# Altium schematic sheet CLK_INPUT.SchDoc: FMC ADC 128CH 10B
size 420 x 297 mm; EDA_Number: ARTIQ; Projet: ARTIQ/SINARA; Author: G.Kasprowicz; CompanyName: WUT ISE; DrawnBy: G.Kasprowicz; Organization: WUT ISE; Address1: PW ISE; Address2: Nowowiejska 15/19 00-665 Warsaw; Address3: gkasprow@gmail.com; DocumentNumber: 1; Revision: 1; SheetNumber: 1; SheetTotal: 9; ModifiedBy: -; CheckedDate: -; Title2: CLK INPUT; DivGrp: WUT ISE; Designer: G.Kasprowicz; ModifiedDate: -; ProjectName: Sensor Box
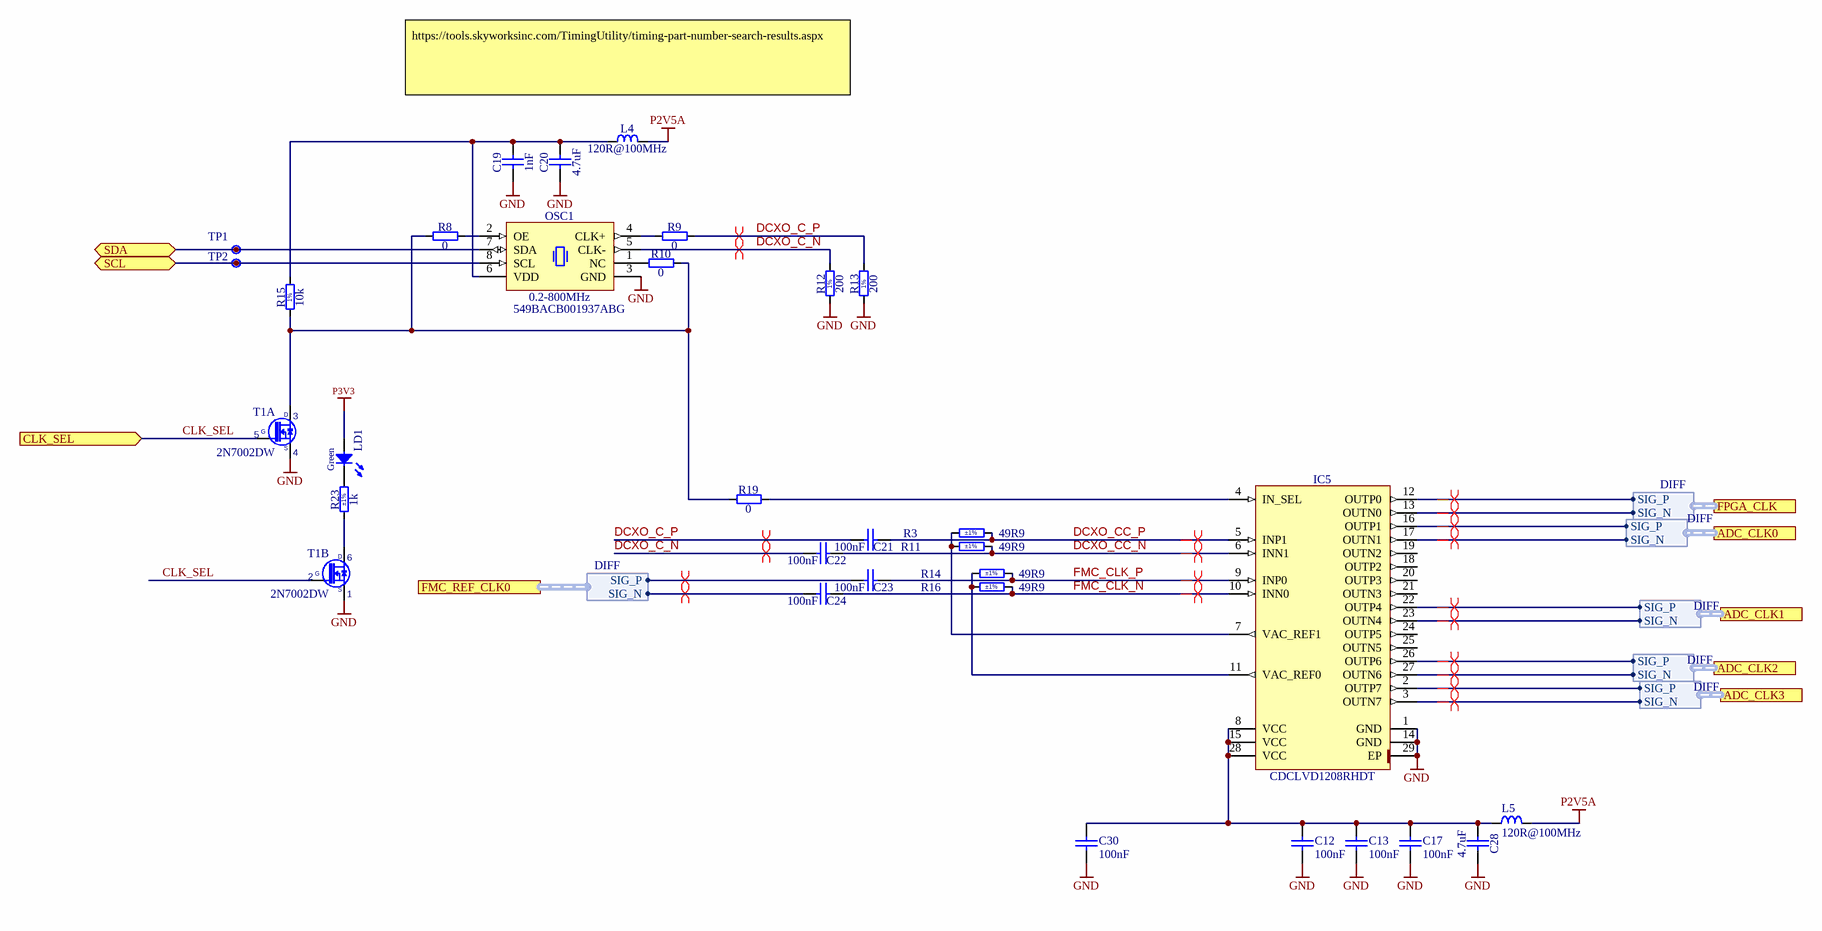
[diagram p0: CLK_INPUT.SchDoc]

## Parts
C12  100nF  [CAPC0603X33N]
C13  100nF  [CAPC0603X33N]
C17  100nF  [CAPC0603X33N]
C19  1nF  [CAPC1005X55N]
C20  4.7uF  [CAPC2012X135N]
C21  100nF  [CAPC0603X33N]
C22  100nF  [CAPC0603X33N]
C23  100nF  [CAPC0603X33N]
C24  100nF  [CAPC0603X33N]
C28  4.7uF  [CAPC2012X135N]
C30  100nF  [CAPC0603X33N]
IC5  CDCLVD1208RHDT  [QFN50P500X500X100-29N-S325]
L4  120R@100MHz  [INDC1608X65N]
L5  120R@100MHz  [INDC1608X95N]
LD1  Green  [LED_KINGBRIGHT_KPA-1606CGCK]
OSC1  0.2-800MHz  Manufacturer Part Number: 549BACB001937ABG  [OSC_SILICON-LAB_SI549-A]
R3  49R9  Tolerance: ±1%  [RESC1005X40N]
R8  0  [RESC1005X40N]
R9  0  [RESC1005X40N]
R10  0  [RESC1005X40N]
R11  49R9  Tolerance: ±1%  [RESC1005X40N]
R12  200  [RESC1005X40N]
R13  200  [RESC1005X40N]
R14  49R9  Tolerance: ±1%  [RESC1005X40N]
R15  10k  [RESC1005X40N]
R16  49R9  Tolerance: ±1%  [RESC1005X40N]
R19  0  [RESC1005X40N]
R23  1k  Tolerance: ±1%  [RESC1005X40N]
T1  2N7002DW  [SOT65P210X110-6N]  (parts A,B of 2)
TP1  I2C SW SDA  [TPS127]  (value not drawn)  (no BOM)
TP2  I2C SW SCL  [TPS127]  (value not drawn)  (no BOM)

## Ports
ADC_CLK0 (harness DIFF), ADC_CLK1 (harness DIFF), ADC_CLK2 (harness DIFF), ADC_CLK3 (harness DIFF), CLK_SEL (in), FMC_REF_CLK0 (harness DIFF), FPGA_CLK (harness DIFF), SCL (bidir), SDA (bidir)

## Harnesses
DIFF: SIG_P, SIG_N

## Nets
GND: C12.1 C13.1 C17.1 C19.1 C20.1 C28.1 C30.1 IC5.1(GND) IC5.14(GND) IC5.29(EP) OSC1.3(GND) R12.1 R13.1 T1.1(S2) T1.4(S1)
P2V5A: L4.1 L5.2
P3V3: LD1.2(A)
CLK_SEL: T1.2(G2) T1.5(G1) ; port CLK_SEL
DCXO_C_N: C22.1 OSC1.5(CLK-) R12.2
DCXO_C_P: C21.1 R9.2 R13.2
DCXO_CC_N: C22.2 IC5.6(INN1) R11.2
DCXO_CC_P: C21.2 IC5.5(INP1) R3.2
FMC_CLK_N: C24.2 IC5.10(INN0) R16.2
FMC_CLK_P: C23.2 IC5.9(INP0) R14.2
SCL: OSC1.8(SCL) TP2.1 ; port SCL
SDA: OSC1.7(SDA) TP1.1 ; port SDA
NetC12_2: C12.2 C13.2 C17.2 C28.2 C30.2 IC5.8(VCC) IC5.15(VCC) IC5.28(VCC) L5.1
NetC19_2: C19.2 C20.2 L4.2 OSC1.6(VDD) R15.2
NetC23_1: C23.1 ; port FMC_REF_CLK0.SIG_P
NetC24_1: C24.1 ; port FMC_REF_CLK0.SIG_N
NetIC5_2: IC5.2(OUTP7) ; port ADC_CLK3.SIG_P
NetIC5_3: IC5.3(OUTN7) ; port ADC_CLK3.SIG_N
NetIC5_4: IC5.4(IN_SEL) R19.2
NetIC5_7: IC5.7(VAC_REF1) R3.1 R11.1
NetIC5_11: IC5.11(VAC_REF0) R14.1 R16.1
NetIC5_12: IC5.12(OUTP0) ; port FPGA_CLK.SIG_P
NetIC5_13: IC5.13(OUTN0) ; port FPGA_CLK.SIG_N
NetIC5_16: IC5.16(OUTP1) ; port ADC_CLK0.SIG_P
NetIC5_17: IC5.17(OUTN1) ; port ADC_CLK0.SIG_N
NetIC5_22: IC5.22(OUTP4) ; port ADC_CLK1.SIG_P
NetIC5_23: IC5.23(OUTN4) ; port ADC_CLK1.SIG_N
NetIC5_26: IC5.26(OUTP6) ; port ADC_CLK2.SIG_P
NetIC5_27: IC5.27(OUTN6) ; port ADC_CLK2.SIG_N
NetLD1_1: LD1.1(C) R23.2
NetOSC1_1: OSC1.1(NC) R10.1
NetOSC1_2: OSC1.2(OE) R8.2
NetOSC1_4: OSC1.4(CLK+) R9.1
NetR8_1: R8.1 R10.2 R15.1 R19.1 T1.3(D1)
NetR23_1: R23.1 T1.6(D2)

Not connected (* = marked no-connect by the designer): IC5 18(OUTP2) 19(OUTN2) 20(OUTP3) 21(OUTN3) 24(OUTP5) 25(OUTN5)

## Layout directives
differential pair; differential pair class Diff_100Ohm: DCXO_C_N, DCXO_C_P
differential pair: DCXO_C_N, DCXO_C_P, DCXO_CC_N, DCXO_CC_P, FMC_CLK_N, FMC_CLK_P, NetC23_1, NetC24_1, NetIC5_2, NetIC5_3, NetIC5_12, NetIC5_13, NetIC5_16, NetIC5_17, NetIC5_22, NetIC5_23, NetIC5_26, NetIC5_27

## Notes on the sheet
- https://tools.skyworksinc.com/TimingUtility/timing-part-number-search-results.aspx
- Project/Equipment
- Document
- Designer
- Drawn by
- Check.by
- Copyright WUT ISE 2018.
  This documentation describes Open Hardware and is licensed under the CERN OHL v.1.1. You may redistribute and modify this documentation under the terms of the CERN OHL v.1.1. (http://ohwr.org/CERNOHL). This documentation is distributed WITHOUT ANY EXPRESS OR IMPLIED WARRANTY, INCLUDING OF MERCHANTABILITY, SATISFACTORY QUALITY AND FITNESS FOR A PARTICULAR PURPOSE. Please see the CERN OHL v.1.1 for applicable conditions.
- Contact
- File
- Last Mod.
- Print Date
- Sheet
- Size
- A3
- of
- Rev
- (in symbol 2N7002DW, part A) D; G; S
- (in symbol 2N7002DW, part B) D; G; S
- (in symbol R0402_10K_1%_0.0625W_100PPM) 1%
- (in symbol R0402_200R_1%_0.0625W_100PPM) 1%

## Library data of the parts
C12 C13 C17 C21-C24 C30 = CC0201_100NF_6.3V_10%_X5R: Non-polarised capacitor; Part Description: SMD Multilayer Chip Ceramic Capacitor; Manufacturer: GENERIC; Manufacturer1 Part Number: 02016D104KAT2A; Voltage: 6.3V; TC: X5R; Tolerance: ±10%; Part Number: CC0201_100NF_6.3V_10%_X5R; Component Kind: Standard; Component Type: Standard; Pin Count: 2; Value: 100nF; Status: Not Recommended; Manufacturer Part Number: CC0201_100NF_6.3V_10%_X5R; Case: 0201; Mounted: Yes; Socket: No; SMD: Yes; Sense: No; Manufacturer1 Example: AVX; Manufacturer1 ComponentHeight: 0.33mm; HelpURL: \\cern.ch\dfs\Applications\Altium\Datasheets\CC0201_X5R_AVX.pdf; Author: CERN DEM JLC; CreateDate: 03.12.2007; LatestRevisionDate: 03.12.2007
C19 = CC0402_1NF_50V_10%_X7R: Non-polarised capacitor; Part Description: SMD Multilayer Chip Ceramic Capacitor; Manufacturer: GENERIC; Manufacturer1 Part Number: 223858715623; Voltage: 50V; TC: X7R; Tolerance: ±10%; Part Number: CC0402_1NF_50V_10%_X7R; Component Kind: Standard; Component Type: Standard; Pin Count: 2; Value: 1nF; Status: Not Recommended; Manufacturer Part Number: CC0402_1NF_50V_10%_X7R; Case: 0402; Mounted: Yes; Socket: No; SMD: Yes; Sense: No; Manufacturer1 Example: PHYCOMP; Manufacturer1 ComponentHeight: 0.55mm; HelpURL: \\cern.ch\dfs\Applications\Altium\Datasheets\CC0402_X7R_PHYCOMP.pdf; Author: CERN DEM JLC; CreateDate: 03.12.2007; LatestRevisionDate: 03.12.2007
C20 C28 = CC0805_4.7UF_10V_10%_X5R: Non-polarised capacitor; Part Description: SMD Multilayer Chip Ceramic Capacitor; Manufacturer: GENERIC; Manufacturer1 Part Number: 222224013672; Voltage: 10V; TC: X5R; Tolerance: ±10%; Part Number: CC0805_4.7UF_10V_10%_X5R; Component Kind: Standard; Component Type: Standard; Pin Count: 2; Value: 4.7uF; Status: Preferred; Manufacturer Part Number: CC0805_4.7UF_10V_10%_X5R; Case: 0805; Mounted: Yes; Socket: No; SMD: Yes; Sense: No; Manufacturer1 Example: PHYCOMP; Manufacturer1 ComponentHeight: 1.45mm; HelpURL: \\cern.ch\dfs\Applications\Altium\Datasheets\CC0805_X5R_PHYCOMP_HC.pdf; Author: CERN DEM JLC; CreateDate: 03.12.2007; LatestRevisionDate: 03.12.2007
IC5 = CDCLVD1208RHDT: 2:8 Low Additive Jitter LVDS Buffer; Manufacturer: TEXAS INSTRUMENTS; PressFit: No; Bonding: No; Part Number: CDCLVD1208RHDT; Component Kind: Standard; Component Type: Standard; Device: CDCLVD1208RHDT; PackageDescription: QFN, 0.50mm Pitch, Square; 28 pin, 5.00mm L X 5.00mm W X 1.00mm H body (w/Thermal Tab 3.25 X 3.25mm), IPC Medium Density; Part Description: 2:8 Low Additive Jitter LVDS Buffer; Manufacturer Part Number: CDCLVD1208RHDT; Pin Count: 29; Case: QFN28; Mounted: Yes; Socket: No; SMD: Yes; Sense: No; ComponentHeight: 1mm; HelpURL: \\cern.ch\dfs\Applications\Altium\Datasheets\CDCLVD1208RHDT.pdf; Author: CERN DEM JLC; CreateDate: 28.06.2012; LatestRevisionDate: 28.06.2012
L4 = IND0603_MURATA_BLM18SG121TN1D: Inductor; Part Description: SMD EMIFIL Suppression Chip Ferrite Bead; Manufacturer: MURATA; Power: 3A; Resistance: 0.025R; Tolerance: ±25%; Part Number: IND0603_MURATA_BLM18SG121TN1D; Component Kind: Standard; Component Type: Standard; Pin Count: 2; Value: 120R@100MHz; Status: None; Manufacturer Part Number: BLM18SG121TN1D; Case: 0603; Mounted: Yes; Socket: No; SMD: Yes; Sense: No; ComponentHeight: 0.65mm; HelpURL: \\cern.ch\dfs\Applications\Altium\Datasheets\IND0603_MURATA_BLM18S.pdf; Author: CERN DEM JLC; CreateDate: 23.07.2014; LatestRevisionDate: 23.07.2014
L5 = IND0603_MURATA_BLM18PG121SN1D: Inductor; Part Description: SMD EMIFIL Chip Ferrite Bead; Manufacturer: MURATA; Power: 2A; Resistance: 0.05R; Part Number: IND0603_MURATA_BLM18PG121SN1D; Component Kind: Standard; Component Type: Standard; Pin Count: 2; Value: 120R@100MHz; Status: None; Manufacturer Part Number: BLM18PG121SN1D; Case: 0603; Mounted: Yes; Socket: No; SMD: Yes; Sense: No; ComponentHeight: 0.95mm; HelpURL: \\cern.ch\dfs\Applications\Altium\Datasheets\IND0603_MURATA_BLM18P.pdf; Author: CERN DEM BC; CreateDate: 2015-07-27; LatestRevisionDate: 2015-07-27
LD1 = LED_KINGBRIGHT_KPA-1606CGCK: LED Green 1C 2A; Part Description: SMD Green LED, Right Angle Mount, Body L 1.6 x W 0.6mm, 1.2mm Thickness; PressFit: No; Bonding: No; Part Number: LED_KINGBRIGHT_KPA-1606CGCK; Component Kind: Standard; Component Type: Standard; Color: Green; PackageDescription: SMT Green LED, Right Angle Mount, Body L 1.6 x W 0.6mm H 1.2mm; Status: Not Recommended; Manufacturer: KINGBRIGHT; Manufacturer Part Number: KPA-1606CGCK; Pin Count: 2; Case: 0603; Mounted: Yes; Socket: No; SMD: Yes; Sense: No; ComponentHeight: 1.2mm; HelpURL: \\cern.ch\dfs\Applications\Altium\Datasheets\LED_KINGBRIGHT_KPA-1606CGCK.pdf; Author: CERN DEM MR; CreateDate: 18.12.2017; LatestRevisionDate: 18.12.2017
OSC1 = OSC_0.2-800MHZ_SILICON-LAB_549BACB001937ABG: Ultra Low Jitter I2C Programmable Crystal Oscillator (XO), Si549 Series; Part Description: 0.2-800MHz, 1.8V/2.5V/3.3V ±20ppm LVDS, Ultra Low Jitter I2C Programmable Crystal Oscillator (XO), Si549 Series; Manufacturer: SILICON LABS; PressFit: No; Bonding: No; Part Number: OSC_0.2-800MHZ_SILICON-LAB_549BACB001937ABG; Component Kind: Standard; Component Type: Standard; PackageDescription: Oscillator Si549 Series, 8 pins, 5x7mm; Value: 0.2-800MHz; Pin Count: 8; Mounted: Yes; Socket: No; SMD: Yes; Sense: No; ComponentHeight: 1.33mm; HelpURL: \\cern.ch\dfs\Applications\Altium\Datasheets\OSC_SILICON-LAB_SI549.pdf; Author: CERN DEM JMW; CreateDate: 27/11/2019; LatestRevisionDate: 02/12/2019
R3 R11 R14 R16 = R0402_49R9_1%_0.0625W_100PPM: Resistor - 1%; Part Description: General Purpose Thick Film Chip Resistor; Manufacturer: GENERIC; Manufacturer1 Part Number: 232270674999L or RC0402FR-0749R9L; TC: ±100ppm/°C; PressFit: No; Part Number: R0402_49R9_1%_0.0625W_100PPM; Component Kind: Standard; Component Type: Standard; Pin Count: 2; Value: 49R9; Status: Not Recommended; Power: 0.0625W; Manufacturer Part Number: R0402_49R9_1%_0.0625W_100PPM; Case: 0402; Mounted: Yes; Sense: No; Socket: No; SMD: Yes; Manufacturer1 Example: YAGEO PHYCOMP; Manufacturer1 ComponentHeight: 0.4mm; HelpURL: \\cern.ch\dfs\Applications\Altium\Datasheets\R0402_Phycomp_RC0402.pdf; Author: CERN DEM JLC; CreateDate: 24.10.2012; LatestRevisionDate: 24.10.2012
R8-R10 R19 = R0402_0R_JUMPER: Resistor; Part Description: 1A (0.05R Max DC Resistance) Zero Ohm Jumper; Manufacturer: GENERIC; Manufacturer1 Part Number: 232270591001L; PressFit: No; Part Number: R0402_0R_JUMPER; Component Kind: Standard; Component Type: Standard; Pin Count: 2; Value: 0; Status: Not Recommended; Manufacturer Part Number: R0402_0R_JUMPER; Case: 0402; Mounted: Yes; Sense: No; Socket: No; SMD: Yes; Manufacturer1 Example: YAGEO PHYCOMP; Manufacturer1 ComponentHeight: 0.4mm; HelpURL: \\cern.ch\dfs\Applications\Altium\Datasheets\R0402_Phycomp_RC0402.pdf; Author: CERN DEM JLC; CreateDate: 03.12.2007; LatestRevisionDate: 17.10.2012
R12 R13 = R0402_200R_1%_0.0625W_100PPM: Resistor - 1%; Part Description: General Purpose Thick Film Chip Resistor; Manufacturer: GENERIC; Manufacturer1 Part Number: 232270672001L; TC: ±100ppm/°C; PressFit: No; Part Number: R0402_200R_1%_0.0625W_100PPM; Component Kind: Standard; Component Type: Standard; Pin Count: 2; Value: 200; Status: Not Recommended; Power: 0.0625W; Tolerance: ±1%; Manufacturer Part Number: R0402_200R_1%_0.0625W_100PPM; Case: 0402; Mounted: Yes; Sense: No; Socket: No; SMD: Yes; Manufacturer1 Example: YAGEO PHYCOMP; Manufacturer1 ComponentHeight: 0.4mm; HelpURL: \\cern.ch\dfs\Applications\Altium\Datasheets\R0402_Phycomp_RC0402.pdf; Author: CERN DEM JLC; CreateDate: 03.12.2007; LatestRevisionDate: 17.10.2012
R15 = R0402_10K_1%_0.0625W_100PPM: Resistor - 1%; Part Description: General Purpose Thick Film Chip Resistor; Manufacturer: GENERIC; Manufacturer1 Part Number: 232270671003L; TC: ±100ppm/°C; Table: Resistors SMD; Part Number: R0402_10K_1%_0.0625W_100PPM; Component Kind: Standard; Component Type: Standard; Pin Count: 2; Value: 10k; Status: Not recommended; Power: 0.0625W; Tolerance: ±1%; Manufacturer Part Number: R0402_10K_1%_0.0625W_100PPM; Case: 0402; Mounted: Yes; Socket: No; SMD: Yes; Manufacturer1 Example: YAGEO PHYCOMP; Manufacturer1 ComponentHeight: 0.4mm; HelpURL: \\cern.ch\dfs\Applications\Altium\Datasheets\R0402_Phycomp_RC0402.pdf; Author: CERN DEM JLC; CreateDate: 3/12/2007; LatestRevisionDate: 17/10/2012
R23 = R0402_1K_1%_0.0625W_100PPM: Resistor - 1%; Part Description: General Purpose Thick Film Chip Resistor; Manufacturer: GENERIC; Manufacturer1 Part Number: 232270671002L; TC: ±100ppm/°C; PressFit: No; Part Number: R0402_1K_1%_0.0625W_100PPM; Component Kind: Standard; Component Type: Standard; Pin Count: 2; Value: 1k; Status: Not Recommended; Power: 0.0625W; Manufacturer Part Number: R0402_1K_1%_0.0625W_100PPM; Case: 0402; Mounted: Yes; Sense: No; Socket: No; SMD: Yes; Manufacturer1 Example: YAGEO PHYCOMP; Manufacturer1 ComponentHeight: 0.4mm; HelpURL: \\cern.ch\dfs\Applications\Altium\Datasheets\R0402_Phycomp_RC0402.pdf; Author: CERN DEM JLC; CreateDate: 03.12.2007; LatestRevisionDate: 17.10.2012
T1 = 2N7002DW: 60 V, 115 mA, Dual N-Channel Field Effect Transistor, Enhancement Mode; Part Description: 60V 115mA Dual N-Channel Field Effect Transistor, Enhancement Mode; Manufacturer: ON SEMICONDUCTOR; PressFit: No; Bonding: No; Part Number: 2N7002DW; Component Kind: Standard; Component Type: Standard; Device: 2N7002DW; PackageDescription: SOT363, SC70-6, 0.65mm Pitch; 6 Pin, 1.25mm W X 2.00mm L X 1.10mm H body, IPC Medium Density; Manufacturer Part Number: 2N7002DW; Pin Count: 6; Case: SOT363; Mounted: Yes; Socket: No; SMD: Yes; Sense: No; ComponentHeight: 1.1mm; HelpURL: \\cern.ch\dfs\Applications\Altium\Datasheets\2N7002DW.pdf; Author: CERN DEM BC; CreateDate: 25.11.2020; LatestRevisionDate: 25.11.2020
TP1 TP2 = SMD_PAD_1.27X1.27MM: Test Point; Part Description: 1.27mm x 1.27mm PCB Copper Area (SMD Test Point); Mounted: No; Part Number: SMD_PAD_1.27X1.27MM; Component Type: Standard (No BOM); Pin Count: 1; Family: Test Point; Socket: No; SMD: Yes; Sense: No; Status: None; ComponentHeight: 0mm; HelpURL: Undefined; Author: CERN DEM JLC; CreateDate: 12.01.2008; LatestRevisionDate: 12.01.2008; PackageDescription: 1.27mm x 1.27mm PCB Copper Area (SMD Test Point)